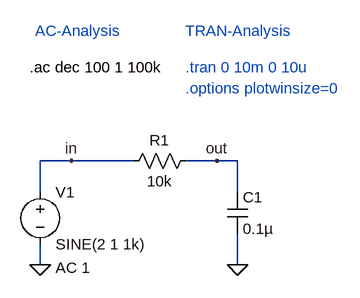
[diagram p0: schematic basics_ac.asc]
basics_ac.asc, the LTspice schematic file:
Version 4
SHEET 1 880 680
WIRE 0 192 -48 192
WIRE 96 192 0 192
WIRE 224 192 176 192
WIRE 256 192 224 192
WIRE -48 240 -48 192
WIRE 256 240 256 192
WIRE -48 352 -48 320
WIRE 256 352 256 304
FLAG 256 352 0
FLAG -48 352 0
FLAG 0 192 in
FLAG 224 192 out
SYMBOL res 80 208 R270
WINDOW 0 32 56 VTop 0
WINDOW 3 0 56 VBottom 0
SYMATTR InstName R1
SYMATTR Value 10k
SYMBOL cap 240 240 R0
SYMATTR InstName C1
SYMATTR Value 0.1µ
SYMBOL voltage -48 224 R0
WINDOW 123 24 132 Left 0
WINDOW 39 0 0 Left 0
SYMATTR Value2 AC 1
SYMATTR InstName V1
SYMATTR Value SINE(2 1 1k)
TEXT 176 48 Left 0 ;.tran 0 10m 0 10u
TEXT 176 80 Left 0 ;.options plotwinsize=0
TEXT -64 48 Left 0 !.ac dec 100 1 100k
TEXT -56 -8 Left 0 ;AC-Analysis
TEXT 176 -8 Left 0 ;TRAN-Analysis

The netlist it stands for:
* basics_ac.asc
R1 in out 10k
C1 out 0 0.1µ
V1 in 0 SINE(2 1 1k) AC 1
* .tran 0 10m 0 10u
* .options plotwinsize=0
.ac dec 100 1 100k
* AC-Analysis
* TRAN-Analysis
.backanno
.end